# Altium project HYLO Module Rev 1.PrjPcb (part 1 of 2)
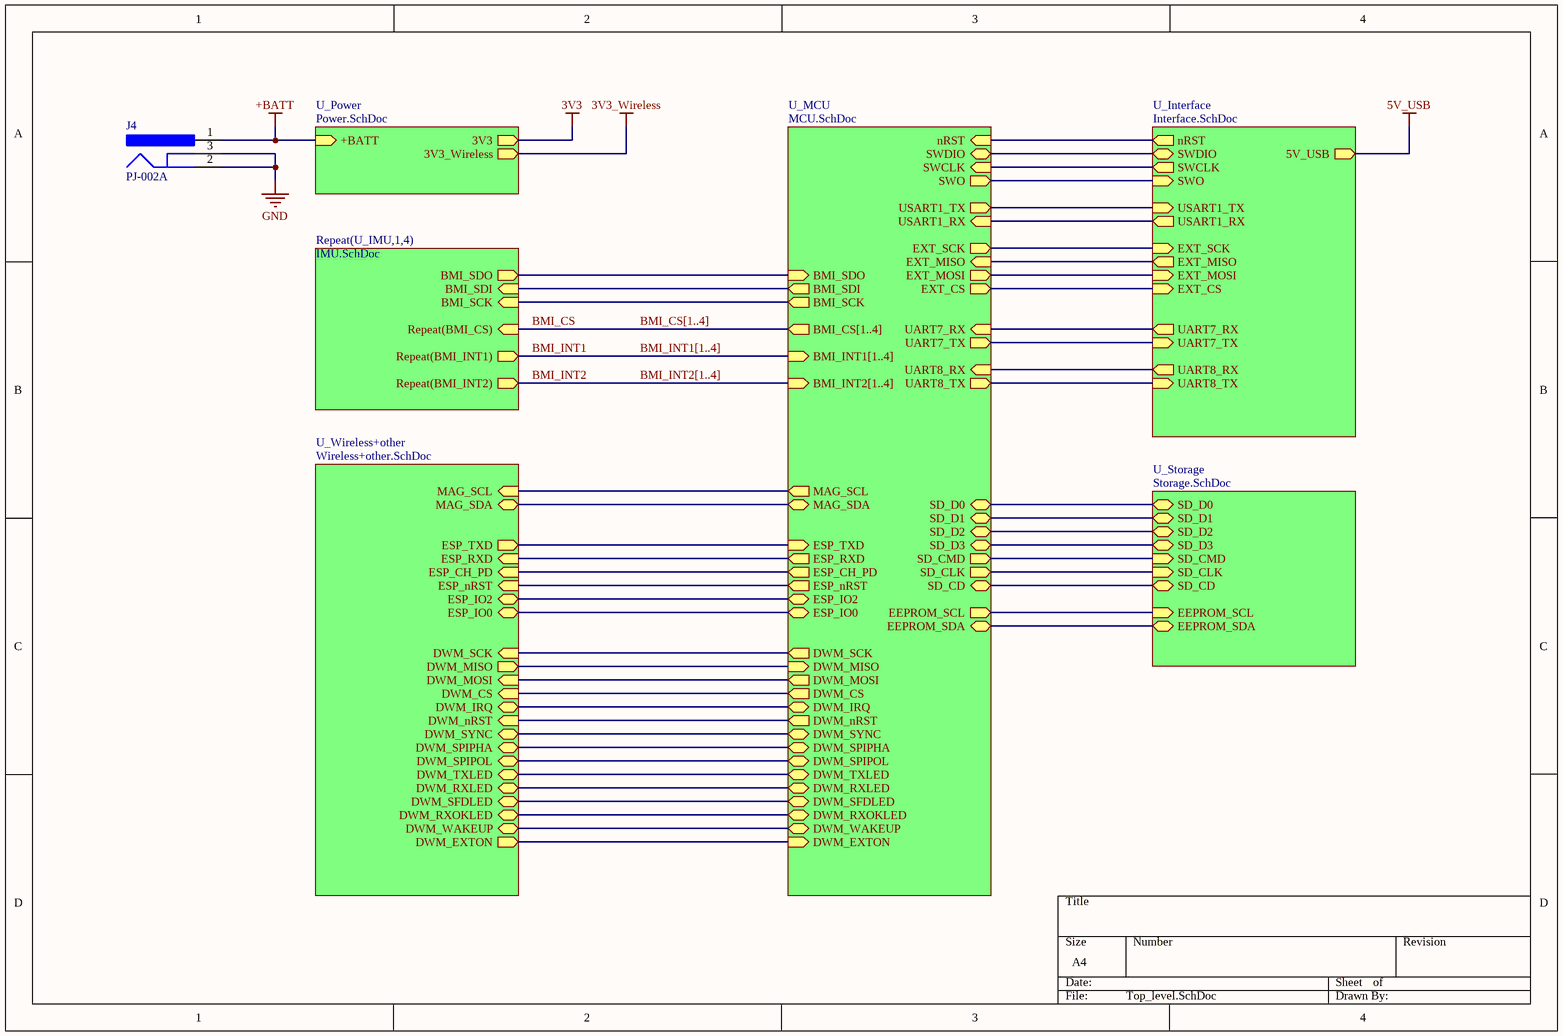
[diagram p0: Top_level.SchDoc]
7 sheets, 122 parts. Net scope: hierarchical (ports join the sheet entries above them; power ports are global).
Board file: PCB1.PcbDoc
Sheets:
  Top_level.SchDoc
    U_MCU = MCU.SchDoc
    U_IMU1 = IMU.SchDoc
    U_IMU2 = IMU.SchDoc
    U_IMU3 = IMU.SchDoc
    U_IMU4 = IMU.SchDoc
    U_Wireless+other = Wireless+other.SchDoc
    U_Interface = Interface.SchDoc
    U_Storage = Storage.SchDoc
    U_Power = Power.SchDoc

## Sheet Top_level.SchDoc
size A4

### Parts
J4  PJ-002A  [CUI-PJ-002A_V]

### Sub-sheets
Repeat(U_IMU,1,4) = IMU.SchDoc: BMI_SDO (out), BMI_SDI (in), BMI_SCK (in), Repeat(BMI_CS) (in), Repeat(BMI_INT1) (out), Repeat(BMI_INT2) (out)
U_Interface = Interface.SchDoc: 5V_USB (out), EXT_SCK (in), EXT_MISO (out), EXT_MOSI (in), EXT_CS (in), SWO (in), nRST (out), UART8_RX (out), UART8_TX (in), SWDIO (bidir), SWCLK (out), UART7_RX (out), UART7_TX (in), USART1_TX (in), USART1_RX (out)
U_MCU = MCU.SchDoc: SWDIO (bidir), SD_D0 (bidir), SD_D1 (bidir), SD_D2 (bidir), SD_D3 (bidir), SD_CD (bidir), SD_CLK (out), SD_CMD (out), EEPROM_SCL (out), EEPROM_SDA (bidir), BMI_CS[1..4] (out), BMI_SDO (in), BMI_SDI (out), BMI_SCK (out), MAG_SCL (out), MAG_SDA (bidir), ESP_RXD (out), ESP_TXD (in), ESP_nRST (out), ESP_CH_PD (out), ESP_IO2 (bidir), ESP_IO0 (bidir), DWM_SCK (out), DWM_MISO (in), DWM_MOSI (out), DWM_CS (out), DWM_nRST (out), DWM_IRQ (bidir), DWM_SYNC (bidir), DWM_SPIPHA (bidir), DWM_SPIPOL (bidir), DWM_TXLED (bidir), DWM_RXLED (bidir), DWM_SFDLED (bidir), DWM_RXOKLED (bidir), DWM_WAKEUP (bidir), DWM_EXTON (in), BMI_INT1[1..4] (in), BMI_INT2[1..4] (in), EXT_SCK (out), EXT_MISO (in), EXT_MOSI (out), EXT_CS (out), SWCLK (in), SWO (out), nRST (in), UART8_TX (out), UART8_RX (in), UART7_RX (in), UART7_TX (out), USART1_TX (out), USART1_RX (in)
U_Power = Power.SchDoc: +BATT (in), 3V3 (out), 3V3_Wireless (out)
U_Storage = Storage.SchDoc: SD_D2 (bidir), SD_D3 (bidir), SD_D1 (bidir), SD_D0 (bidir), SD_CMD (in), SD_CLK (in), SD_CD (bidir), EEPROM_SCL (in), EEPROM_SDA (bidir)
U_Wireless+other = Wireless+other.SchDoc: MAG_SCL (in), MAG_SDA (bidir), ESP_TXD (out), ESP_nRST (in), ESP_CH_PD (in), ESP_IO2 (bidir), ESP_IO0 (bidir), ESP_RXD (in), DWM_SCK (in), DWM_MOSI (in), DWM_MISO (out), DWM_CS (in), DWM_nRST (in), DWM_IRQ (bidir), DWM_EXTON (out), DWM_WAKEUP (bidir), DWM_SYNC (bidir), DWM_SPIPHA (bidir), DWM_SPIPOL (bidir), DWM_TXLED (bidir), DWM_RXLED (bidir), DWM_SFDLED (bidir), DWM_RXOKLED (bidir)

### Nets
+BATT: J4.1 ; sheet U_Power/+BATT
GND: J4.2 J4.3
BMI_CS: sheet Repeat(U_IMU,1,4)/Repeat(BMI_CS)
BMI_INT1: sheet Repeat(U_IMU,1,4)/Repeat(BMI_INT1)
BMI_INT2: sheet Repeat(U_IMU,1,4)/Repeat(BMI_INT2)
BMI_MISO: sheet U_MCU/BMI_SDO, sheet Repeat(U_IMU,1,4)/BMI_SDO
BMI_MOSI: sheet U_MCU/BMI_SDI, sheet Repeat(U_IMU,1,4)/BMI_SDI
BMI_SCK: sheet U_MCU/BMI_SCK, sheet Repeat(U_IMU,1,4)/BMI_SCK
DWM_CS: sheet U_MCU/DWM_CS, sheet U_Wireless+other/DWM_CS
DWM_EXTON: sheet U_MCU/DWM_EXTON, sheet U_Wireless+other/DWM_EXTON
DWM_IRQ: sheet U_MCU/DWM_IRQ, sheet U_Wireless+other/DWM_IRQ
DWM_MISO: sheet U_MCU/DWM_MISO, sheet U_Wireless+other/DWM_MISO
DWM_MOSI: sheet U_MCU/DWM_MOSI, sheet U_Wireless+other/DWM_MOSI
DWM_nRST: sheet U_MCU/DWM_nRST, sheet U_Wireless+other/DWM_nRST
DWM_RXLED: sheet U_MCU/DWM_RXLED, sheet U_Wireless+other/DWM_RXLED
DWM_RXOKLED: sheet U_MCU/DWM_RXOKLED, sheet U_Wireless+other/DWM_RXOKLED
DWM_SCK: sheet U_MCU/DWM_SCK, sheet U_Wireless+other/DWM_SCK
DWM_SFDLED: sheet U_MCU/DWM_SFDLED, sheet U_Wireless+other/DWM_SFDLED
DWM_SPIPHA: sheet U_MCU/DWM_SPIPHA, sheet U_Wireless+other/DWM_SPIPHA
DWM_SPIPOL: sheet U_MCU/DWM_SPIPOL, sheet U_Wireless+other/DWM_SPIPOL
DWM_SYNC: sheet U_MCU/DWM_SYNC, sheet U_Wireless+other/DWM_SYNC
DWM_TXLED: sheet U_MCU/DWM_TXLED, sheet U_Wireless+other/DWM_TXLED
DWM_WAKEUP: sheet U_MCU/DWM_WAKEUP, sheet U_Wireless+other/DWM_WAKEUP
EEPROM_SCL: sheet U_MCU/EEPROM_SCL, sheet U_MCU/MAG_SCL, sheet U_Wireless+other/MAG_SCL, sheet U_Storage/EEPROM_SCL
EEPROM_SDA: sheet U_MCU/EEPROM_SDA, sheet U_MCU/MAG_SDA, sheet U_Wireless+other/MAG_SDA, sheet U_Storage/EEPROM_SDA
ESP_CH_PD: sheet U_MCU/ESP_CH_PD, sheet U_Wireless+other/ESP_CH_PD
ESP_IO0: sheet U_MCU/ESP_IO0, sheet U_Wireless+other/ESP_IO0
ESP_IO2: sheet U_MCU/ESP_IO2, sheet U_Wireless+other/ESP_IO2
ESP_nRST: sheet U_MCU/ESP_nRST, sheet U_Wireless+other/ESP_nRST
ESP_RXD: sheet U_MCU/ESP_RXD, sheet U_Wireless+other/ESP_RXD
ESP_TXD: sheet U_MCU/ESP_TXD, sheet U_Wireless+other/ESP_TXD
EXT_CS: sheet U_MCU/EXT_CS, sheet U_Interface/EXT_CS
EXT_MISO: sheet U_MCU/EXT_MISO, sheet U_Interface/EXT_MISO
EXT_MOSI: sheet U_MCU/EXT_MOSI, sheet U_Interface/EXT_MOSI
EXT_RX: sheet U_MCU/UART7_TX, sheet U_Interface/UART7_TX
EXT_SCK: sheet U_MCU/EXT_SCK, sheet U_Interface/EXT_SCK
EXT_TX: sheet U_MCU/UART7_RX, sheet U_Interface/UART7_RX
nRST: sheet U_MCU/nRST, sheet U_Interface/nRST
SD_CD: sheet U_MCU/SD_CD, sheet U_Storage/SD_CD
SD_CLK: sheet U_MCU/SD_CLK, sheet U_Storage/SD_CLK
SD_CMD: sheet U_MCU/SD_CMD, sheet U_Storage/SD_CMD
SD_D0: sheet U_MCU/SD_D0, sheet U_Storage/SD_D0
SD_D1: sheet U_MCU/SD_D1, sheet U_Storage/SD_D1
SD_D2: sheet U_MCU/SD_D2, sheet U_Storage/SD_D2
SD_D3: sheet U_MCU/SD_D3, sheet U_Storage/SD_D3
SWCLK: sheet U_MCU/SWCLK, sheet U_Interface/SWCLK
SWDIO: sheet U_MCU/SWDIO, sheet U_Interface/SWDIO
SWO: sheet U_MCU/SWO, sheet U_Interface/SWO
T_VCP_RX: sheet U_MCU/UART8_RX, sheet U_Interface/UART8_RX
T_VCP_TX: sheet U_MCU/UART8_TX, sheet U_Interface/UART8_TX
USART1_RX: sheet U_MCU/USART1_RX, sheet U_Interface/USART1_RX
USART1_TX: sheet U_MCU/USART1_TX, sheet U_Interface/USART1_TX

### Buses and harness runs
bus BMI_CS[1..4] = sheet U_MCU/BMI_CS[1..4]
bus BMI_INT1[1..4] = sheet U_MCU/BMI_INT1[1..4]
bus BMI_INT2[1..4] = sheet U_MCU/BMI_INT2[1..4]

### Library data of the parts
J4 = CMP-2000-06895-2: Through Hole Right Angle DC Power Jack, 2.5 A, 2 mm Center Pin, 3 Position, -25 to 85 degC, RoHS, Bulk; Manufacturer: CUIInc.; Brand: CUI; Inside Contact Diameter: 2mm; Voltage Rating: 24V; Outside Contact Diameter: 6.5mm; Current Rating: 2.5A; Insulation Resistance: 50MOhms; Contact Gender: Male; Connector Type: DCPowerJack; Datasheet Version: Rev. 1.03, 04/2016; Housing Material: PolybutyleneTerephthalate(PBT); Operating Temperature Range: -25Cto+85C; Termination Style: ThroughHole; Product Category: DCPowerConnectors; Mounting Technology: ThroughHole; Mounting Style: ThroughHole; Factory Pack Quantity: 500; Contact Plating: Nickel; Package Reference: PJ-002A; Mounting Angle: Right; Package Description: 3-Pin Through Hole Device, Body 14.4 x 9 mm, Height 11 mm; Flammability Rating: UL94V-0; Manufacturer URL: http://www.cui.com/; Product: Jacks; Contact Material: Copper; Datasheet URL: http://www.cui.com/product/resource/pj-002a.pdf; RoHS: True

## Sheet MCU.SchDoc
size A3
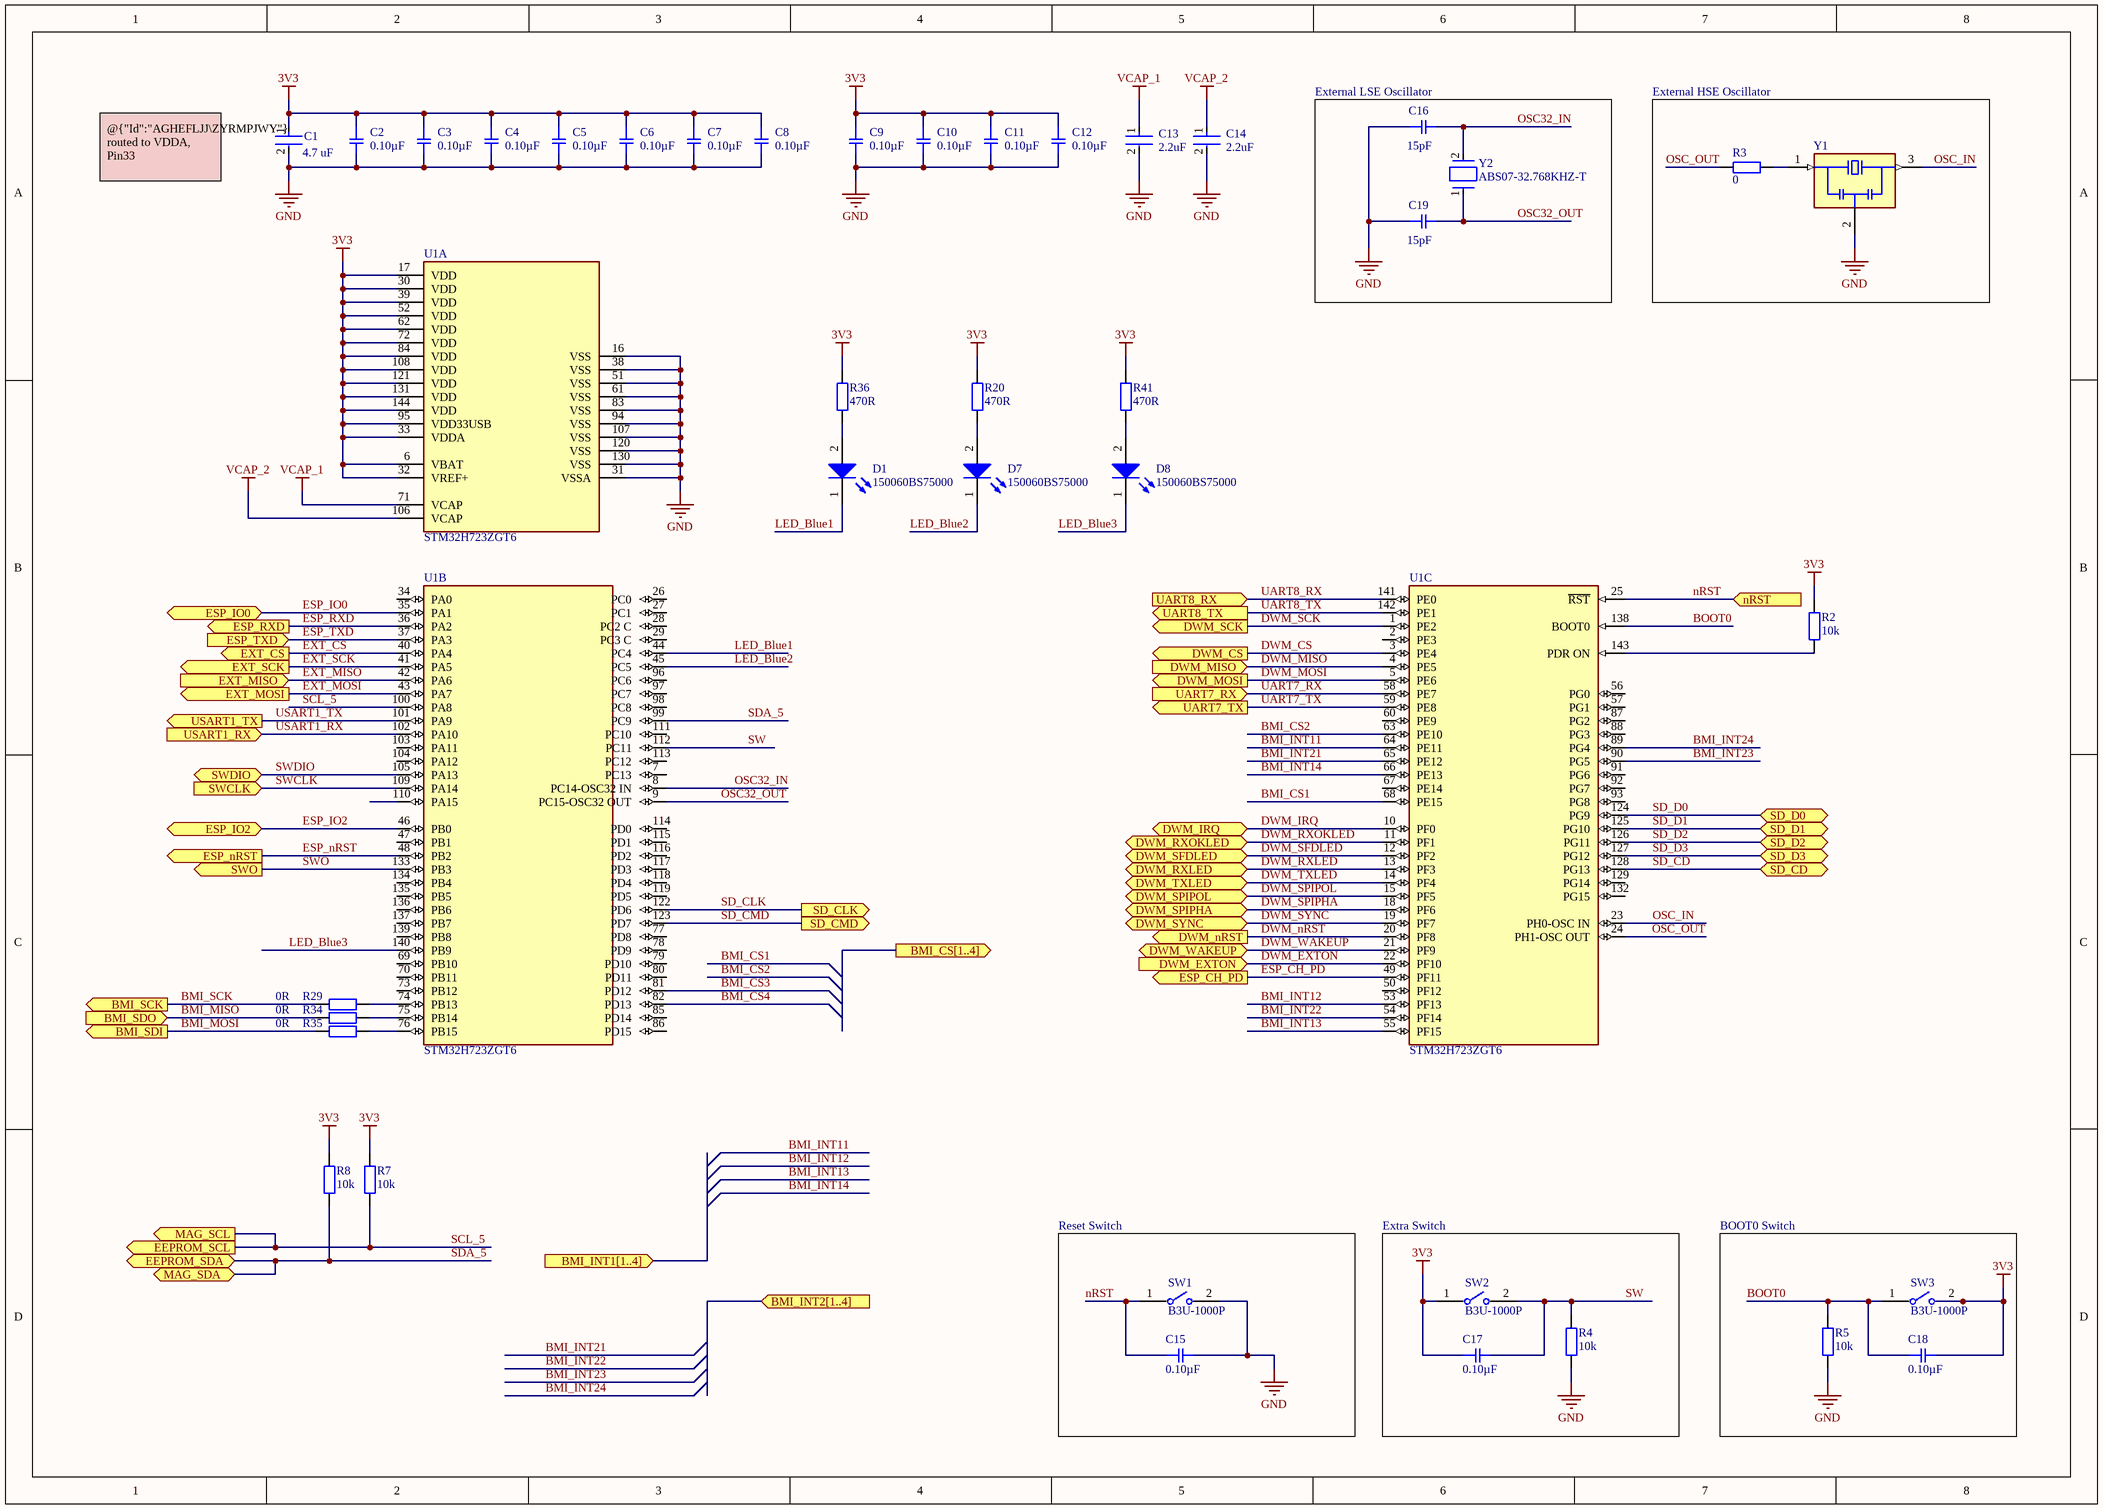
[diagram p1: MCU.SchDoc]

### Parts
C1  value 4.7 uF  [FP-CC0805-0_85-MFG]  (hidden comment: CC0805KKX7R8BB475)
C2  value 0.10µF  [SMD-0402C]  (hidden comment: GRM155R61A104KA01J)
C3  value 0.10µF  [SMD-0402C]  (hidden comment: GRM155R61A104KA01J)
C4  value 0.10µF  [SMD-0402C]  (hidden comment: GRM155R61A104KA01J)
C5  value 0.10µF  [SMD-0402C]  (hidden comment: GRM155R61A104KA01J)
C6  value 0.10µF  [SMD-0402C]  (hidden comment: GRM155R61A104KA01J)
C7  value 0.10µF  [SMD-0402C]  (hidden comment: GRM155R61A104KA01J)
C8  value 0.10µF  [SMD-0402C]  (hidden comment: GRM155R61A104KA01J)
C9  value 0.10µF  [SMD-0402C]  (hidden comment: GRM155R61A104KA01J)
C10  value 0.10µF  [SMD-0402C]  (hidden comment: GRM155R61A104KA01J)
C11  value 0.10µF  [SMD-0402C]  (hidden comment: GRM155R61A104KA01J)
C12  value 0.10µF  [SMD-0402C]  (hidden comment: GRM155R61A104KA01J)
C13  Capacitance: 2.2uF  [FP-GRM21B-0_15-IPC_A]  (hidden comment: GRM21BR71E225KE11L)
C14  Capacitance: 2.2uF  [FP-GRM21B-0_15-IPC_A]  (hidden comment: GRM21BR71E225KE11L)
C15  value 0.10µF  [SMD-0402C]  (hidden comment: GRM155R61A104KA01J)
C16  value 15pF  [SMD-0402C]  (hidden comment: GRM1555C1H150FA01D)
C17  value 0.10µF  [SMD-0402C]  (hidden comment: GRM155R61A104KA01J)
C18  value 0.10µF  [SMD-0402C]  (hidden comment: GRM155R61A104KA01J)
C19  value 15pF  [SMD-0402C]  (hidden comment: GRM1555C1H150FA01D)
D1  150060BS75000  [WL-SMCW_0603_150060xx75000]
D7  150060BS75000  [WL-SMCW_0603_150060xx75000]
D8  150060BS75000  [WL-SMCW_0603_150060xx75000]
R2  10k  [IPC C R0402 NO SILK]
R3  value 0  [IPC C R0402 NO SILK]  (hidden comment: 0R)
R4  10k  [IPC C R0402 NO SILK]
R5  10k  [IPC C R0402 NO SILK]
R7  10k  [IPC C R0402 NO SILK]
R8  10k  [IPC C R0402 NO SILK]
R20  470R  [IPC C R0402 NO SILK]
R29  0R  [IPC C R0402 NO SILK]
R34  0R  [IPC C R0402 NO SILK]
R35  0R  [IPC C R0402 NO SILK]
R36  470R  [IPC C R0402 NO SILK]
R41  470R  [IPC C R0402 NO SILK]
SW1  B3U-1000P  [FP-B3U-1000P-MFG]
SW2  B3U-1000P  [FP-B3U-1000P-MFG]
SW3  B3U-1000P  [FP-B3U-1000P-MFG]
U1  STM32H723ZGT6  [FP-LQFP144-1A-IPC_A]  (parts A,B,C of 3)
Y1  CSTNE8M00G550000R0  [OSC_CSTNE8M00G550000R0]  (value not drawn)
Y2  ABS07-32.768KHZ-T  [FP-ABS07-MFG]

### Blocks framed on the sheet
External LSE Oscillator: C16 C19 Y2
External HSE Oscillator: R3 Y1
Reset Switch: C15 SW1
Extra Switch: C17 R4 SW2
BOOT0 Switch: C18 R5 SW3

### Ports
BMI_CS[1..4] (out), BMI_INT1[1..4] (in), BMI_INT2[1..4] (in), BMI_SCK (out), BMI_SDI (out), BMI_SDO (in), DWM_CS (out), DWM_EXTON (in), DWM_IRQ (bidir), DWM_MISO (in), DWM_MOSI (out), DWM_nRST (out), DWM_RXLED (bidir), DWM_RXOKLED (bidir), DWM_SCK (out), DWM_SFDLED (bidir), DWM_SPIPHA (bidir), DWM_SPIPOL (bidir), DWM_SYNC (bidir), DWM_TXLED (bidir), DWM_WAKEUP (bidir), EEPROM_SCL (out), EEPROM_SDA (bidir), ESP_CH_PD (out), ESP_IO0 (bidir), ESP_IO2 (bidir), ESP_nRST (out), ESP_RXD (out), ESP_TXD (in), EXT_CS (out), EXT_MISO (in), EXT_MOSI (out), EXT_SCK (out), MAG_SCL (out), MAG_SDA (bidir), nRST (in), SD_CD (bidir), SD_CLK (out), SD_CMD (out), SD_D0 (bidir), SD_D1 (bidir), SD_D2 (bidir), SD_D3 (bidir), SWCLK (in), SWDIO (bidir), SWO (out), UART7_RX (in), UART7_TX (out), UART8_RX (in), UART8_TX (out), USART1_RX (in), USART1_TX (out)

### Nets
3V3: C1.1 C2.1 C3.1 C4.1 C5.1 C6.1 C7.1 C8.1 C9.1 C10.1 C11.1 C12.1 C17.1 C18.2 R2.1 R7.1 R8.1 R20.2 R36.2 R41.2 SW2.1 SW3.2 U1.6(VBAT) U1.17(VDD) U1.30(VDD) U1.32(VREF+) U1.33(VDDA) U1.39(VDD) U1.52(VDD) U1.62(VDD) U1.72(VDD) U1.84(VDD) U1.95(VDD33USB) U1.108(VDD) U1.121(VDD) U1.131(VDD) U1.144(VDD)
GND: C1.2 C2.2 C3.2 C4.2 C5.2 C6.2 C7.2 C8.2 C9.2 C10.2 C11.2 C12.2 C13.2 C14.2 C15.2 C16.1 C19.1 R4.1 R5.1 SW1.2 U1.16(VSS) U1.31(VSSA) U1.38(VSS) U1.51(VSS) U1.61(VSS) U1.83(VSS) U1.94(VSS) U1.107(VSS) U1.120(VSS) U1.130(VSS) Y1.2(GND)
VCAP_1: C13.1 U1.71(VCAP)
VCAP_2: C14.1 U1.106(VCAP)
BMI_CS1: U1.68(PE15)
BMI_CS2: U1.63(PE10)
BMI_CS3: U1.81(PD12)
BMI_CS4: U1.82(PD13)
BMI_INT11: U1.64(PE11)
BMI_INT12: U1.53(PF13)
BMI_INT13: U1.55(PF15)
BMI_INT14: U1.66(PE13)
BMI_INT21: U1.65(PE12)
BMI_INT22: U1.54(PF14)
BMI_INT23: U1.90(PG5)
BMI_INT24: U1.89(PG4)
BMI_MISO: R34.1 ; port BMI_SDO
BMI_MOSI: R35.1 ; port BMI_SDI
BMI_SCK: R29.1 ; port BMI_SCK
BOOT0: C18.1 R5.2 SW3.1 U1.138(BOOT0)
DWM_CS: U1.3(PE4) ; port DWM_CS
DWM_EXTON: U1.22(PF10) ; port DWM_EXTON
DWM_IRQ: U1.10(PF0) ; port DWM_IRQ
DWM_MISO: U1.4(PE5) ; port DWM_MISO
DWM_MOSI: U1.5(PE6) ; port DWM_MOSI
DWM_nRST: U1.20(PF8) ; port DWM_nRST
DWM_RXLED: U1.13(PF3) ; port DWM_RXLED
DWM_RXOKLED: U1.11(PF1) ; port DWM_RXOKLED
DWM_SCK: U1.1(PE2) ; port DWM_SCK
DWM_SFDLED: U1.12(PF2) ; port DWM_SFDLED
DWM_SPIPHA: U1.18(PF6) ; port DWM_SPIPHA
DWM_SPIPOL: U1.15(PF5) ; port DWM_SPIPOL
DWM_SYNC: U1.19(PF7) ; port DWM_SYNC
DWM_TXLED: U1.14(PF4) ; port DWM_TXLED
DWM_WAKEUP: U1.21(PF9) ; port DWM_WAKEUP
ESP_CH_PD: U1.49(PF11) ; port ESP_CH_PD
ESP_IO0: U1.35(PA1) ; port ESP_IO0
ESP_IO2: U1.46(PB0) ; port ESP_IO2
ESP_nRST: U1.48(PB2) ; port ESP_nRST
ESP_RXD: U1.36(PA2) ; port ESP_RXD
ESP_TXD: U1.37(PA3) ; port ESP_TXD
EXT_CS: U1.40(PA4) ; port EXT_CS
EXT_MISO: U1.42(PA6) ; port EXT_MISO
EXT_MOSI: U1.43(PA7) ; port EXT_MOSI
EXT_SCK: U1.41(PA5) ; port EXT_SCK
LED_Blue1: D1.1(K) U1.44(PC4)
LED_Blue2: D7.1(K) U1.45(PC5)
LED_Blue3: D8.1(K) U1.140(PB9)
nRST: C15.1 SW1.1 U1.25(~{RST}) ; port nRST
OSC32_IN: C16.2 U1.8(PC14-OSC32_IN) Y2.2
OSC32_OUT: C19.2 U1.9(PC15-OSC32_OUT) Y2.1
OSC_IN: U1.23(PH0-OSC_IN) Y1.3(OUT)
OSC_OUT: R3.2 U1.24(PH1-OSC_OUT)
SCL_5: R7.2 U1.100(PA8) ; port EEPROM_SCL, port MAG_SCL  [project net EEPROM_SCL]
SD_CD: U1.128(PG13) ; port SD_CD
SD_CLK: U1.122(PD6) ; port SD_CLK
SD_CMD: U1.123(PD7) ; port SD_CMD
SD_D0: U1.124(PG9) ; port SD_D0
SD_D1: U1.125(PG10) ; port SD_D1
SD_D2: U1.126(PG11) ; port SD_D2
SD_D3: U1.127(PG12) ; port SD_D3
SDA_5: R8.2 U1.99(PC9) ; port EEPROM_SDA, port MAG_SDA  [project net EEPROM_SDA]
SW: C17.2 R4.2 SW2.2 U1.112(PC11)
SWCLK: U1.109(PA14) ; port SWCLK
SWDIO: U1.105(PA13) ; port SWDIO
SWO: U1.133(PB3) ; port SWO
UART7_RX: U1.58(PE7) ; port UART7_RX  [project net EXT_TX]
UART7_TX: U1.59(PE8) ; port UART7_TX  [project net EXT_RX]
UART8_RX: U1.141(PE0) ; port UART8_RX  [project net T_VCP_RX]
UART8_TX: U1.142(PE1) ; port UART8_TX  [project net T_VCP_TX]
USART1_RX: U1.102(PA10) ; port USART1_RX
USART1_TX: U1.101(PA9) ; port USART1_TX
NetD1_2: D1.2(A) R36.1
NetD7_2: D7.2(A) R20.1
NetD8_2: D8.2(A) R41.1
NetR2_2: R2.2 U1.143(PDR_ON)
NetR3_1: R3.1 Y1.1(IN)
NetR29_2: R29.2 U1.74(PB13)
NetR34_2: R34.2 U1.75(PB14)
NetR35_2: R35.2 U1.76(PB15)

Not connected (* = marked no-connect by the designer): U1 2(PE3) 7(PC13) 26(PC0) 27(PC1) 28(PC2_C) 29(PC3_C) 34(PA0) 47(PB1) 50(PF12) 56(PG0) 57(PG1) 60(PE9) 67(PE14) 69(PB10) 70(PB11) 73(PB12) 77(PD8) 78(PD9) 79(PD10) 80(PD11) 85(PD14) 86(PD15) 87(PG2) 88(PG3) 91(PG6) 92(PG7) 93(PG8) 96(PC6) 97(PC7) 98(PC8) 103(PA11) 104(PA12) 110(PA15) 111(PC10) 113(PC12) 114(PD0) 115(PD1) 116(PD2) 117(PD3) 118(PD4) 119(PD5) 129(PG14) 132(PG15) 134(PB4) 135(PB5) 136(PB6) 137(PB7) 139(PB8)

### Notes on the sheet
- @{"Id":"AGHEFLJJ\ZYRMPJWY"} routed to VDDA, Pin33

### Library data of the parts
C1 = CMP-03422-000306-1: CAP CER 4.7UF 25V X7R 0805; Manufacturer: Yageo; Material: Ceramic; Tolerance: 0.1; ComponentLink2Description: Datasheet; Footprint Url: http://www.yageo.com/exep/pages/download/literatures/UPY-C_GEN_24.pdf; Temperature Range High: +85°C; Package: CC0805-0.85; Octopart: https://octopart.com/cc0805kkx7r8bb475-yageo-51849247; Mouser Description: Multilayer Ceramic Capacitors MLCC - SMD/SMT 4.7M pF 10% 25 Volts; Capacitance: 4.7 uF; Ipc Land Pattern Name: CAPC200125X85; Temperature: -30°C to +85°C; Digikey Description: CAP CER 4.7UF 25V X7R 0805; Temperature Characteristic: X7R; Temperature Range Low: -30°C; Lead Free: Yes; RoHS: TRUE; Device Class L3: Ceramic Capacitors; ComponentLink2URL: http://www.yageo.com/documents/recent/UPY-GPHC_Y5V_6.3V-to-50V_8.pdf; Category: Cap; Device Class L2: Capacitors; Manufacturer Part Number: CC0805KKX7R8BB475; Device Class L1: Passive Components; Height: 0.95mm; Automotive: No; Voltage Rating: 25 V
C2-C12 C15 C17 C18 = CMP-140-000687-1: CAP CER 0.1UF 10V X5R 0402; Manufacturer: Murata Electronics North America; Factory Stock: 0; Unit Price (USD): 0.1; Minimum Quantity: 1; Tolerance: ±10%; Ratings: -; Lead Spacing: -; Source: capacitor_murata_0402$.SchLib; Part Status: Active; Pin Count: 2; Digi-Key Part Number: 490-6297-1-ND; Operating Temperature: -55°C ~ 85°C; Height - Seated (Max): -; Voltage: 10V; @ qty: 0; Temperature Coefficient: X5R; Package / Case: 0402 (1005 Metric); Size / Dimension: 0.039" L x 0.020" W (1.00mm x 0.50mm); Quantity Available: 24406; Datasheets: http://www.murata.com/~/media/webrenewal/support/library/catalog/products/capacitor/mlcc/c02e.pdf; Series: GRM; Applications: General Purpose; Thickness (Max): 0.022" (0.55mm); Image: //media.digikey.com/Renders/Murata%20Renders/ZRB-SERIES-0402.jpg; Packaging: Cut Tape (CT); Part Number: GRM155R61A104KA01J; Features: -; Component Type: Standard; Mounting Type: Surface Mount, MLCC; Design Item ID: GRM155R61A104KA01J
C13 C14 = CMP-06035-028354-1: Chip Multilayer Ceramic Capacitors for General Purpose, 0805, 2.2uF, X7R, 15%, 10%, 25V; Voltage Rating (DC): 25V; Thickness: 1.25mm; Dielectric: X7R; Tolerance: 10%; Length: 2mm; Width: 1.25mm
C16 C19 = CMP-140-000297-1: CAP CER 15PF 50V NP0 0402; Manufacturer: Murata Electronics North America; Minimum Quantity: 1; Factory Stock: 0; Tolerance: ±1%; Unit Price (USD): 0.1; Temperature Coefficient: C0G, NP0; Component Type: Standard; Features: -; Part Status: Active; Thickness (Max): 0.022" (0.55mm); Quantity Available: 187310; Design Item ID: GRM1555C1H150FA01D; Datasheets: http://www.murata.com/~/media/webrenewal/support/library/catalog/products/capacitor/mlcc/c02e.pdf; Image: //media.digikey.com/Renders/Murata%20Renders/ZRB-SERIES-0402.jpg; Applications: General Purpose; Packaging: Cut Tape (CT); Height - Seated (Max): -; Source: capacitor_murata_0402$.SchLib; Ratings: -; Lead Style: -; Voltage: 50V; Lead Spacing: -; Pin Count: 2; Mounting Type: Surface Mount, MLCC; Digi-Key Part Number: 490-6200-1-ND; Size / Dimension: 0.039" L x 0.020" W (1.00mm x 0.50mm); Package / Case: 0402 (1005 Metric); Operating Temperature: -55°C ~ 125°C; Series: GRM; Part Number: GRM1555C1H150FA01D; @ qty: 0
D1 D7 D8 = CMP-1426-00003-4: Led, Blue, 470 Nm, 3.2 V, 30 Ma, 145 Mcd Rohs Compliant: Yes; Peak Wavelength: 465nm; Dominant Wavelength: 470nm; Power Dissipation: 105mW; Viewing Angle: 140°; Test Current: 20mA; Max Junction Temperature (Tj): 95°C; Forward Current: 100mA; Reverse Voltage: 5V; Luminous Intensity: 145mcd; Lens Style: Clear, Rectangular; Forward Voltage: 3.2V; RoHS: Compliant; Min Operating Temperature: -40°C; REACH SVHC: Unknown; Max Operating Temperature: 85°C; Width: 800µm; Case Code (Imperial): 0603; Case Code (Metric): 1608; Max Reverse Voltage (DC): 5V; Height: 700µm; Case/Package: 0603; Mount: Surface Mount; Packaging: Tape and Reel; Color: Blue; Wavelength: 470nm; Length: 1.6mm
R2-R5 R7 R8 R20 R29 R34-R36 R41 = CMP-009-00183-1: Design Item ID: Generic RES 0402; Source: Schlib1.SchLib
  R2 R4 R5 R7 R8: Value: 10k
  R20 R36 R41: Value: 470R
  R29 R34 R35: Value: 0R
SW1-SW3 = CMP-2100-03586-2: SWITCH TACTILE SPST-NO 0.05A 12V; Contact Resistance: 100mR; Operating Force: 1.5N; Max Current Rating: 50mA; Switch Travel: 0.15mm; Actuator Type: Standard; Mechanical Life: 200000Cycles; Ratings: Dust Proof; Illumination Type: Non-Illuminated; Throw Configuration: SPST; Actuator Length: 0.4mm; Switch Function: Off-Mom; Height: 1.2mm; Width: 3mm; Weight: 0.000776oz; Contact Material: Silver; Max Voltage Rating (DC): 12V; Insulation Resistance: 100MR; Lead Free: Lead Free; Current Rating: 50mA; Termination: SMD/SMT; Length: 4mm; Voltage Rating (DC): 12V; Contact Current Rating: 50mA; Orientation: Straight; Depth: 2.5mm; Max Operating Temperature: 70°C; Packaging: Tape and Reel; Min Operating Temperature: -25°C; Package Quantity: 1; Mount: Surface Mount; Electrical Life: 200000Cycles
U1 = CMP-12105-000148-1: IC MCU 32BIT 1MB FLASH 144LQFP
Y1 = CMP-001-00084-2: 8 MHz Ceramic Resonator Built in Capacitor 33 pF Â±0.2% 40 Ohms -40Â°C ~ 85Â°C Surface Mount; MF: Murata Electronics; Check_prices: https://www.snapeda.com/parts/CSTNE8M00G550000R0/Murata+Electronics+North+America/view-part/?ref=eda; Case/Package: SMD-3 Murata; Source: CSTNE8M00G550000R0.SchLib; SnapEDA_Link: https://www.snapeda.com/parts/CSTNE8M00G550000R0/Murata+Electronics+North+America/view-part/?ref=snap; MP: CSTNE8M00G550000R0; Design Item ID: CSTNE8M00G550000R0; Component Type: Standard; Pins: 3
Y2 = CMP-0447-00001-4: Crystal 32.768kHz ±20ppm (Tol) 12.5pF FUND 70kΩ 2-Pin CSMD T/R; ESR (Equivalent Series Resistance): 70kR; Radiation Hardening: No; Frequency: 32.768kHz; Length: 3.2mm; Max Operating Temperature: 85°C; Number of Pins: 2; Series: ABS07; Min Operating Temperature: -40°C; Frequency Tolerance: 20ppm; Packaging: Tape and Reel; Height: 0.9mm; Width: 1.5mm; Depth: 1.5mm; Load Capacitance: 12.5pF; RoHS Compliant: Yes; Tolerance: 20ppm; Termination: SMD/SMT; Lead Free: Lead Free; Series Resistance: 70kR; REACH SVHC: No SVHC; Case/Package: CSMD; Operating Frequency: 32.768 kHz; Package Quantity: 3000

## Sheet IMU.SchDoc
size A4
Used 4 times, as channels U_IMU1, U_IMU2, U_IMU3, U_IMU4. Parts and nets are listed once, with the designators drawn on the sheet.
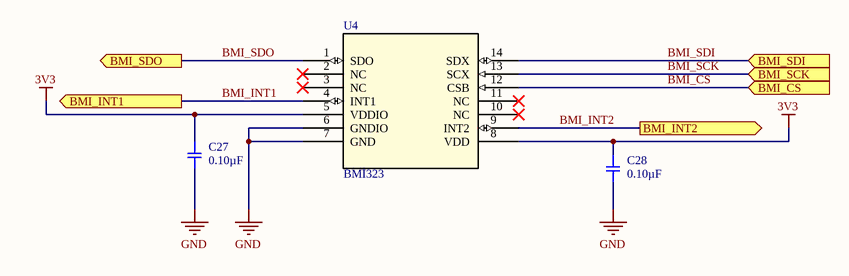
[diagram p2: IMU.SchDoc]

### Parts
C27  value 0.10µF  [SMD-0402C]  (hidden comment: GRM155R61A104KA01J)
C28  value 0.10µF  [SMD-0402C]  (hidden comment: GRM155R61A104KA01J)
U4  BMI323  [BMI323_BOS]

### Ports
BMI_CS (in), BMI_INT1 (out), BMI_INT2 (out), BMI_SCK (in), BMI_SDI (in), BMI_SDO (out)

### Nets
3V3: C27.1 C28.1 U4.5(VDDIO) U4.8(VDD)
GND: C27.2 C28.2 U4.6(GNDIO) U4.7(GND)
BMI_CS: U4.12(CSB) ; port BMI_CS
BMI_INT1: U4.4(INT1) ; port BMI_INT1
BMI_INT2: U4.9(INT2) ; port BMI_INT2
BMI_SCK: U4.13(SCX) ; port BMI_SCK
BMI_SDI: U4.14(SDX) ; port BMI_SDI
BMI_SDO: U4.1(SDO) ; port BMI_SDO

Not connected (* = marked no-connect by the designer): U4 2(NC)* 3(NC)* 10(NC)* 11(NC)*

### Channels
U_IMU1: designators end in _U_IMU1; ports BMI_CS=BMI_CS_U_IMU1 BMI_INT1=BMI_INT1_U_IMU1 BMI_INT2=BMI_INT2_U_IMU1 BMI_SCK=BMI_SCK BMI_SDI=BMI_MOSI BMI_SDO=BMI_MISO
U_IMU2: designators end in _U_IMU2; ports BMI_CS=BMI_CS_U_IMU2 BMI_INT1=BMI_INT1_U_IMU2 BMI_INT2=BMI_INT2_U_IMU2 BMI_SCK=BMI_SCK BMI_SDI=BMI_MOSI BMI_SDO=BMI_MISO
U_IMU3: designators end in _U_IMU3; ports BMI_CS=BMI_CS_U_IMU3 BMI_INT1=BMI_INT1_U_IMU3 BMI_INT2=BMI_INT2_U_IMU3 BMI_SCK=BMI_SCK BMI_SDI=BMI_MOSI BMI_SDO=BMI_MISO
U_IMU4: designators end in _U_IMU4; ports BMI_CS=BMI_CS_U_IMU4 BMI_INT1=BMI_INT1_U_IMU4 BMI_INT2=BMI_INT2_U_IMU4 BMI_SCK=BMI_SCK BMI_SDI=BMI_MOSI BMI_SDO=BMI_MISO

### Library data of the parts
C27 C28 = CMP-140-000687-1: as C2 on sheet MCU; Ratings: -; Lead Spacing: -; Source: capacitor_murata_0402$.SchLib; Part Status: Active; Pin Count: 2; Digi-Key Part Number: 490-6297-1-ND; Operating Temperature: -55°C ~ 85°C; Height - Seated (Max): -; Voltage: 10V; @ qty: 0; Temperature Coefficient: X5R; Package / Case: 0402 (1005 Metric); Size / Dimension: 0.039" L x 0.020" W (1.00mm x 0.50mm); Quantity Available: 24406; Datasheets: http://www.murata.com/~/media/webrenewal/support/library/catalog/products/capacitor/mlcc/c02e.pdf; Series: GRM; Applications: General Purpose; Thickness (Max): 0.022" (0.55mm); Image: //media.digikey.com/Renders/Murata%20Renders/ZRB-SERIES-0402.jpg; Packaging: Cut Tape (CT); Part Number: GRM155R61A104KA01J; Features: -; Component Type: Standard; Mounting Type: Surface Mount, MLCC; Design Item ID: GRM155R61A104KA01J
U4 = CMP-036-000000-1: Description; Manufacturer_Name: Bosch Sensortec; Design Item ID: BMI323; Pin Count: 14; RefDes: RefDes; Type: Type; Manufacturer_Part_Number: BMI323; Copyright: Copyright (C) 2025 Ultra Librarian. All rights reserved.; Source: BMI323.SchLib; Component Type: Standard

## Sheet Wireless+other.SchDoc
size A4
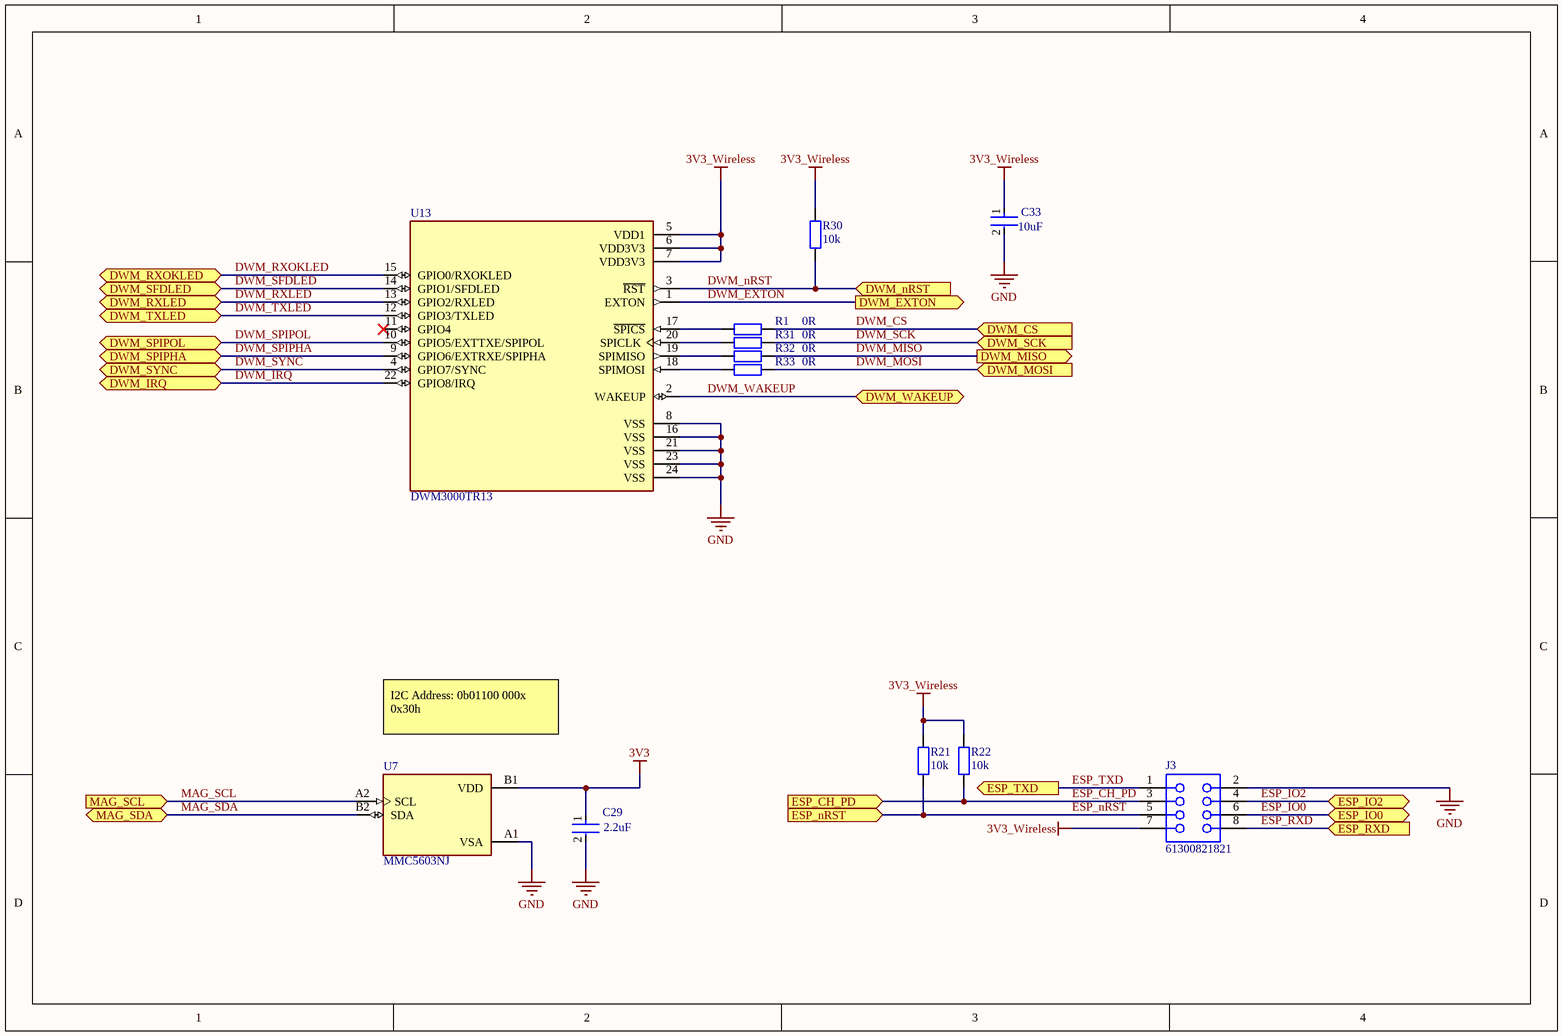
[diagram p3: Wireless+other.SchDoc]

### Parts
C29  Capacitance: 2.2uF  [FP-GRM155-0_05-MFG]  (hidden comment: GRM155R61A225KE95D)
C33  Capacitance: 10uF  [FP-GRM18-0_15-MFG]  (hidden comment: GRM188R61A106KE69D)
J3  61300821821  [61300821821]
R1  0R  [IPC C R0402 NO SILK]
R21  10k  [IPC C R0402 NO SILK]
R22  10k  [IPC C R0402 NO SILK]
R30  10k  [IPC C R0402 NO SILK]
R31  0R  [IPC C R0402 NO SILK]
R32  0R  [IPC C R0402 NO SILK]
R33  0R  [IPC C R0402 NO SILK]
U7  MMC5603NJ  [XDCR_MMC5603NJ]
U13  DWM3000TR13  [XCVR_DWM3000TR13]

### Ports
DWM_CS (in), DWM_EXTON (out), DWM_IRQ (bidir), DWM_MISO (out), DWM_MOSI (in), DWM_nRST (in), DWM_RXLED (bidir), DWM_RXOKLED (bidir), DWM_SCK (in), DWM_SFDLED (bidir), DWM_SPIPHA (bidir), DWM_SPIPOL (bidir), DWM_SYNC (bidir), DWM_TXLED (bidir), DWM_WAKEUP (bidir), ESP_CH_PD (in), ESP_IO0 (bidir), ESP_IO2 (bidir), ESP_nRST (in), ESP_RXD (in), ESP_TXD (out), MAG_SCL (in), MAG_SDA (bidir)

### Nets
3V3: C29.1 U7.B1(VDD)
3V3_Wireless: C33.1 J3.7 R21.1 R22.1 R30.2 U13.5(VDD1) U13.6(VDD3V3) U13.7(VDD3V3)
GND: C29.2 C33.2 J3.2 U7.A1(VSA) U13.8(VSS) U13.16(VSS) U13.21(VSS) U13.23(VSS) U13.24(VSS)
DWM_CS: R1.1 ; port DWM_CS
DWM_EXTON: U13.1(EXTON) ; port DWM_EXTON
DWM_IRQ: U13.22(GPIO8/IRQ) ; port DWM_IRQ
DWM_MISO: R32.1 ; port DWM_MISO
DWM_MOSI: R33.1 ; port DWM_MOSI
DWM_nRST: R30.1 U13.3(~{RST}) ; port DWM_nRST
DWM_RXLED: U13.13(GPIO2/RXLED) ; port DWM_RXLED
DWM_RXOKLED: U13.15(GPIO0/RXOKLED) ; port DWM_RXOKLED
DWM_SCK: R31.1 ; port DWM_SCK
DWM_SFDLED: U13.14(GPIO1/SFDLED) ; port DWM_SFDLED
DWM_SPIPHA: U13.9(GPIO6/EXTRXE/SPIPHA) ; port DWM_SPIPHA
DWM_SPIPOL: U13.10(GPIO5/EXTTXE/SPIPOL) ; port DWM_SPIPOL
DWM_SYNC: U13.4(GPIO7/SYNC) ; port DWM_SYNC
DWM_TXLED: U13.12(GPIO3/TXLED) ; port DWM_TXLED
DWM_WAKEUP: U13.2(WAKEUP) ; port DWM_WAKEUP
ESP_CH_PD: J3.3 R22.2 ; port ESP_CH_PD
ESP_IO0: J3.6 ; port ESP_IO0
ESP_IO2: J3.4 ; port ESP_IO2
ESP_nRST: J3.5 R21.2 ; port ESP_nRST
ESP_RXD: J3.8 ; port ESP_RXD
ESP_TXD: J3.1 ; port ESP_TXD
MAG_SCL: U7.A2(SCL) ; port MAG_SCL  [project net EEPROM_SCL]
MAG_SDA: U7.B2(SDA) ; port MAG_SDA  [project net EEPROM_SDA]
NetR1_2: R1.2 U13.17(~{SPICS})
NetR31_2: R31.2 U13.20(SPICLK)
NetR32_2: R32.2 U13.19(SPIMISO)
NetR33_2: R33.2 U13.18(SPIMOSI)

Not connected (* = marked no-connect by the designer): U13 11(GPIO4)*

### Notes on the sheet
- I2C Address: 0b01100 000x
  0x30h

### Library data of the parts
C29 = CMP-06035-063009-1: CAP CER 2.2UF 10V X5R 0402; Material: Ceramic; Tolerance: 10%; Max Operating Temperature: 85°C; Min Operating Temperature: -55°C; Weight: 0.000212oz; Lead Free: Lead Free; Case Code (Imperial): 0402; Case Code (Metric): 1005; Length: 1mm; Packaging: Tape and Reel; Depth: 0.5mm; Voltage Rating: 10V; REACH SVHC: No SVHC; Width: 0.5mm; Case/Package: 0402; RoHS Compliant: Yes; Termination: SMD/SMT; Voltage Rating (DC): 10V; Height: 0.5mm; Mount: Surface Mount; Package Quantity: 10000; Dielectric: X5R; Thickness: 0.022inch
C33 = CMP-2000-05448-2: CAP CER 10UF 10V X5R 0603; Manufacturer: Murata; Temperature Coefficient: 15%; Material: Ceramic; Tolerance: 10%; Device Class L1: Passive Components; ComponentLink2Description: Datasheet; Height: 0.95mm; Package: GRM18-0.15; Octopart: https://octopart.com/grm188r61a106ke69d-murata-22851381; Manufacturer Part Number: GRM188R61A106KE69D; Value: 10uF; Digikey Description: CAP CER 10UF 10V X5R 0603; Temperature Range High: +85°C; Temperature Range Low: -55°C; Temperature Characteristic: X5R; RoHS: TRUE; Device Class L2: Capacitors; ComponentLink2URL: https://search.murata.co.jp/Ceramy/image/img/A01X/G101/ENG/GRM188R61A106KE69-01A.pdf; Device Class L3: Ceramic Capacitors; Lead Free: Yes; Mouser Description: Multilayer Ceramic Capacitors MLCC - SMD/SMT 0603 10uF 10volts X5R + - 10%; Category: Cap; Voltage Rating: 10V; Temperature: -55°C to +85°C; Automotive: No
J3 = CMP-1502-01329-3: NexarPartId: 61924725; Operating Supply Voltage: 250V; Contact Resistance: 20mΩ; Gender: Female; Current Rating: 3A; RoHS: Non-Compliant; Lead Pitch: 2.54mm; Number of Pins: 8; Orientation: Vertical
R1 R21 R22 R30-R33 = CMP-009-00183-1: Design Item ID: Generic RES 0402; Source: Schlib1.SchLib
  R1 R31-R33: Value: 0R
  R21 R22 R30: Value: 10k
U7 = CMP-044-000000-1: Magnetoresistive Sensor X, Y, Z Axis 4-WLP (0.82x0.82); MF: Memsic Inc.; Design Item ID: MMC5603NJ; Value: *; Pin Count: 4; MP: MMC5603NJ; Check_prices: https://www.snapeda.com/parts/MMC5603NJ/Memsic+Inc./view-part/?ref=eda; Availability: In Stock; Price: None; Component Type: Standard; SnapEDA_Link: https://www.snapeda.com/parts/MMC5603NJ/Memsic+Inc./view-part/?ref=snap; Source: MMC5603NJ.SchLib; Package: UFBGA-4 Memsic Inc.; Purchase-URL: https://pricing.snapeda.com/search/part/MMC5603NJ/?ref=eda
U13 = CMP-046-000000-1: 802.15.4, Bluetooth, Cellular UWB, ZigbeeÂ® Transceiver Module 6.25GHz ~ 8.25GHz Integrated, Ceramic Patch Surface Mount; MF: Qorvo; Design Item ID: DWM3000TR13; Package: None; SnapEDA_Link: https://www.snapeda.com/parts/DWM3000TR13/Qorvo/view-part/?ref=snap; Check_prices: https://www.snapeda.com/parts/DWM3000TR13/Qorvo/view-part/?ref=eda; Value: *; MP: DWM3000TR13; Source: DWM3000TR13.SchLib; Pin Count: 24; Component Type: Standard

## Sheet Interface.SchDoc
size B
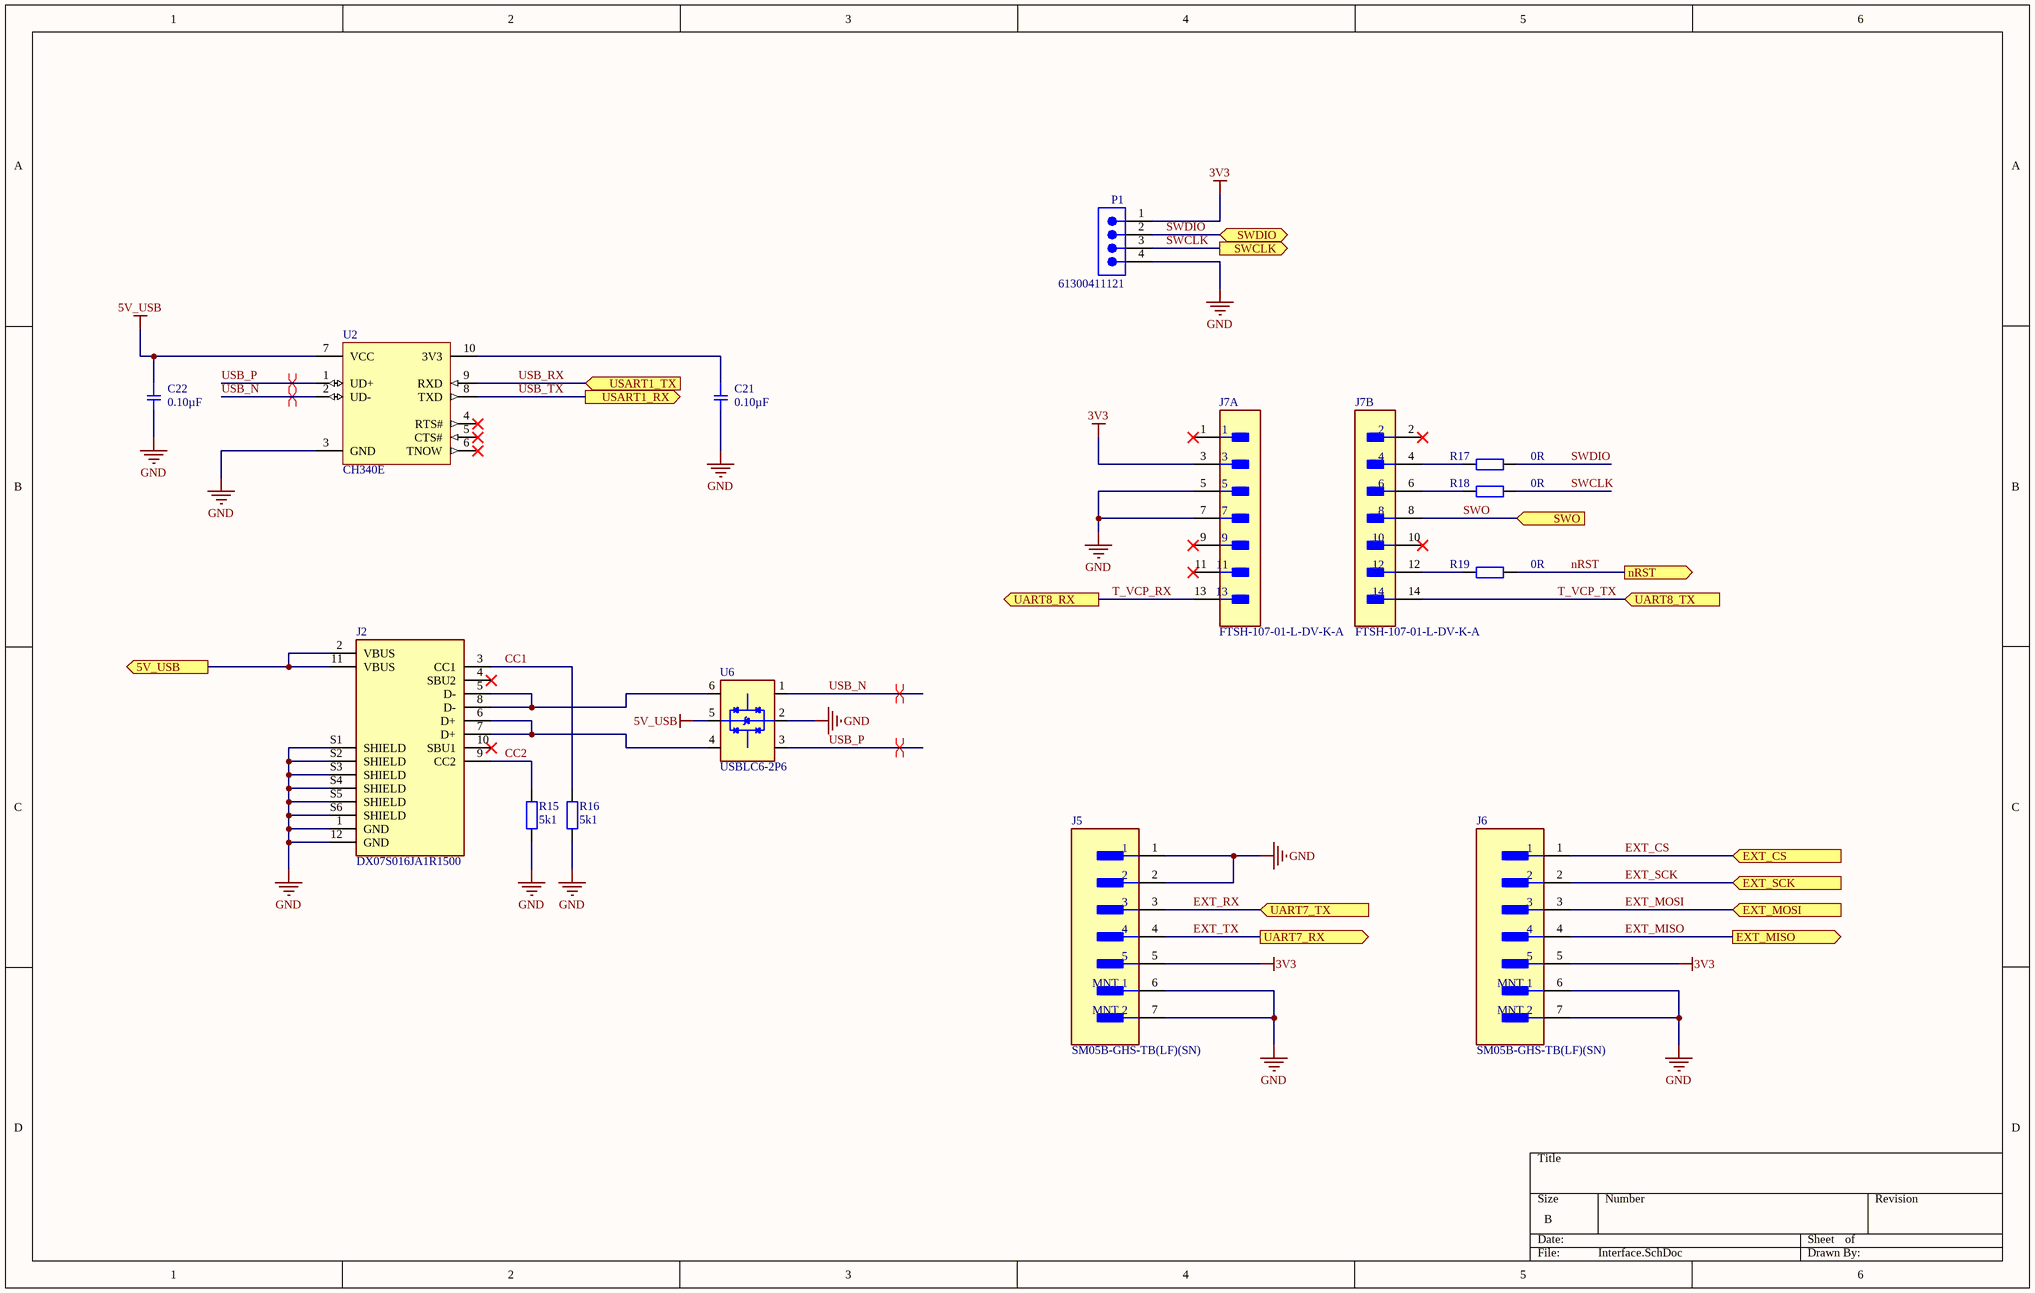
[diagram p4: Interface.SchDoc]

### Parts
C21  value 0.10µF  [SMD-0402C]  (hidden comment: GRM155R61A104KA01J)
C22  value 0.10µF  [SMD-0402C]  (hidden comment: GRM155R61A104KA01J)
J2  DX07S016JA1R1500  [JAE_DX07S016JA1R1500]
J5  SM05B-GHS-TB(LF)(SN)  [FP-SM05B-GHS-TB_LF_SN-MFG]
J6  SM05B-GHS-TB(LF)(SN)  [FP-SM05B-GHS-TB_LF_SN-MFG]
J7  FTSH-107-01-L-DV-K-A  [FP-FTSH-107-01-L-DV-K-A-MFG]  (parts A,B of 2)
P1  61300411121  [61300411121]
R15  value 5k1  [IPC C R0402 NO SILK]  (hidden comment: 5.1k)
R16  value 5k1  [IPC C R0402 NO SILK]  (hidden comment: 5.1k)
R17  0R  [IPC C R0402 NO SILK]
R18  0R  [IPC C R0402 NO SILK]
R19  0R  [IPC C R0402 NO SILK]
U2  CH340E  [MSOP-UN10_L]
U6  USBLC6-2P6  [SOT50P160X60-6N]

### Ports
5V_USB (out), EXT_CS (in), EXT_MISO (out), EXT_MOSI (in), EXT_SCK (in), nRST (out), SWCLK (out), SWDIO (bidir), SWO (in), UART7_RX (out), UART7_TX (in), UART8_RX (out), UART8_TX (in), USART1_RX (out), USART1_TX (in)

### Nets
3V3: J5.5 J6.5 J7.3 P1.1
5V_USB: C22.1 J2.2(VBUS) J2.11(VBUS) U2.7(VCC) U6.5(VBUS) ; port 5V_USB
GND: C21.2 C22.2 J2.1(GND) J2.12(GND) J2.S1(SHIELD) J2.S2(SHIELD) J2.S3(SHIELD) J2.S4(SHIELD) J2.S5(SHIELD) J2.S6(SHIELD) J5.1 J5.2 J5.6(MNT_1) J5.7(MNT_2) J6.6(MNT_1) J6.7(MNT_2) J7.5 J7.7 P1.4 R15.2 R16.2 U2.3(GND) U6.2(GND)
CC1: J2.3(CC1) R16.1
CC2: J2.9(CC2) R15.1
EXT_CS: J6.1 ; port EXT_CS
EXT_MISO: J6.4 ; port EXT_MISO
EXT_MOSI: J6.3 ; port EXT_MOSI
EXT_RX: J5.3 ; port UART7_TX
EXT_SCK: J6.2 ; port EXT_SCK
EXT_TX: J5.4 ; port UART7_RX
nRST: R19.2 ; port nRST
SWCLK: P1.3 R18.2 ; port SWCLK
SWDIO: P1.2 R17.2 ; port SWDIO
SWO: J7.8 ; port SWO
T_VCP_RX: J7.13 ; port UART8_RX
T_VCP_TX: J7.14 ; port UART8_TX
USB_N: U2.2(UD-) U6.1(I/O1_1)
USB_P: U2.1(UD+) U6.3(I/O2_1)
USB_RX: U2.9(RXD) ; port USART1_TX  [project net USART1_TX]
USB_TX: U2.8(TXD) ; port USART1_RX  [project net USART1_RX]
NetC21_1: C21.1 U2.10(3V3)
NetJ2_5: J2.5(D-) J2.8(D-) U6.6(I/O1_2)
NetJ2_6: J2.6(D+) J2.7(D+) U6.4(I/O2_2)
NetJ7_4: J7.4 R17.1
NetJ7_6: J7.6 R18.1
NetJ7_12: J7.12 R19.1

Not connected (* = marked no-connect by the designer): J2 4(SBU2)* 10(SBU1)*; J7 1* 2* 9* 10* 11*; U2 4(RTS#)* 5(CTS#)* 6(TNOW)*

### Layout directives
differential pair: USB_N, USB_P

### Library data of the parts
C21 C22 = CMP-140-000687-1: as C2 on sheet MCU; Ratings: -; Lead Spacing: -; Source: capacitor_murata_0402$.SchLib; Part Status: Active; Pin Count: 2; Digi-Key Part Number: 490-6297-1-ND; Operating Temperature: -55°C ~ 85°C; Height - Seated (Max): -; Voltage: 10V; @ qty: 0; Temperature Coefficient: X5R; Package / Case: 0402 (1005 Metric); Size / Dimension: 0.039" L x 0.020" W (1.00mm x 0.50mm); Quantity Available: 24406; Datasheets: http://www.murata.com/~/media/webrenewal/support/library/catalog/products/capacitor/mlcc/c02e.pdf; Series: GRM; Applications: General Purpose; Thickness (Max): 0.022" (0.55mm); Image: //media.digikey.com/Renders/Murata%20Renders/ZRB-SERIES-0402.jpg; Packaging: Cut Tape (CT); Part Number: GRM155R61A104KA01J; Features: -; Component Type: Standard; Mounting Type: Surface Mount, MLCC; Design Item ID: GRM155R61A104KA01J
J2 = CMP-003-000003-4: USB-C (USB TYPE-C) USB 2.0 Receptacle Connector 24 (16+8 Dummy) Position Surface Mount, Right Angle; Through Hole; Pin Count: 18; Component Type: Standard; Availability: Unavailable; Design Item ID: DX07S016JA1R1500; Price: None; Value: *; Source: DX07S016JA1R1500.SchLib; Package: None; MP: DX07S016JA1R1500
J5 J6 = CMP-17439-000048-1: CONN HEADER SMD R/A 5POS 1.25MM; Current Rating: 1A; Pitch: 0.049inch; Connector Type: Outer Shroud Contact; Number of Positions: 5; Voltage Rating (AC): 50V; Wire/Cable Gauge: 26AWG; Series: GH; Mount: Surface Mount; Housing Material: Nylon; Contact Type: Outer Shroud Contact; REACH SVHC: No SVHC; Number of Rows: 1; Lead Free: Lead Free; Color: Natural; Contact Material: Bronze; Contact Plating: Tin; Max Operating Temperature: 85°C; Orientation: Right Angle; Number of Contacts: 5; Voltage Rating: 50V; Housing Color: Natural; Termination: Solder; Min Operating Temperature: -25°C; Fastening Type: Ramp; Packaging: Tape and Reel
J7 = CMP-02766-001414-1: CONN HEADER SMD 14POS 1.27MM; Number of Contacts: 14; Gender: Male; Contact Plating: Gold; Termination: Solder; Lead Free: Lead Free; Contact Material: Bronze; Pitch: 1.27mm; Number of Rows: 2; RoHS Compliant: Yes
P1 = CMP-1502-01064-4: THT Vertical Pin Header WR-PHD, Pitch 2.54 mm, Single Row, 4 pins; Connector Type: Male Pin; Gender: Male; Current Rating: 3A; Number of Positions: 4; Operating Supply Voltage: 250V; Contact Resistance: 20mΩ; Pitch: 2.54mm; Max Operating Temperature: 105°C; Mount: Through Hole; Contact Material: Gold; Contact Plating: Gold; Number of Contacts: 4; Orientation: Vertical; Packaging: Bulk; Contact Mating Length: 5.9944mm; Voltage Rating: 250V; Number of Rows: 1; Height: 8.89mm; Lead Free: Lead Free; Lead Pitch: 2.54mm; Number of Pins: 4; Color: Black; Min Operating Temperature: -40°C; RoHS: Compliant; Termination: Solder
R15-R19 = CMP-009-00183-1: Design Item ID: Generic RES 0402; Source: Schlib1.SchLib
  R17-R19: Value: 0R
U2 = CMP-023-000028-1: Source: Schlib1.SchLib; Design Item ID: CH340E
U6 = CMP-004-00043-1: 17V Clamp 5A (8/20Âµs) Ipp Tvs Diode Surface Mount SOT-666; MF: STMicroelectronics; Component Type: Standard; Check_prices: https://www.snapeda.com/parts/USBLC6-2P6/STMicroelectronics/view-part/?ref=eda; Value: *; Design Item ID: USBLC6-2P6; MP: USBLC6-2P6; Pins: 6; Case/Package: SOT-666 STMicroelectronics; SnapEDA_Link: https://www.snapeda.com/parts/USBLC6-2P6/STMicroelectronics/view-part/?ref=snap; Source: USBLC6-2P6.SchLib

## Sheet Storage.SchDoc
size A4
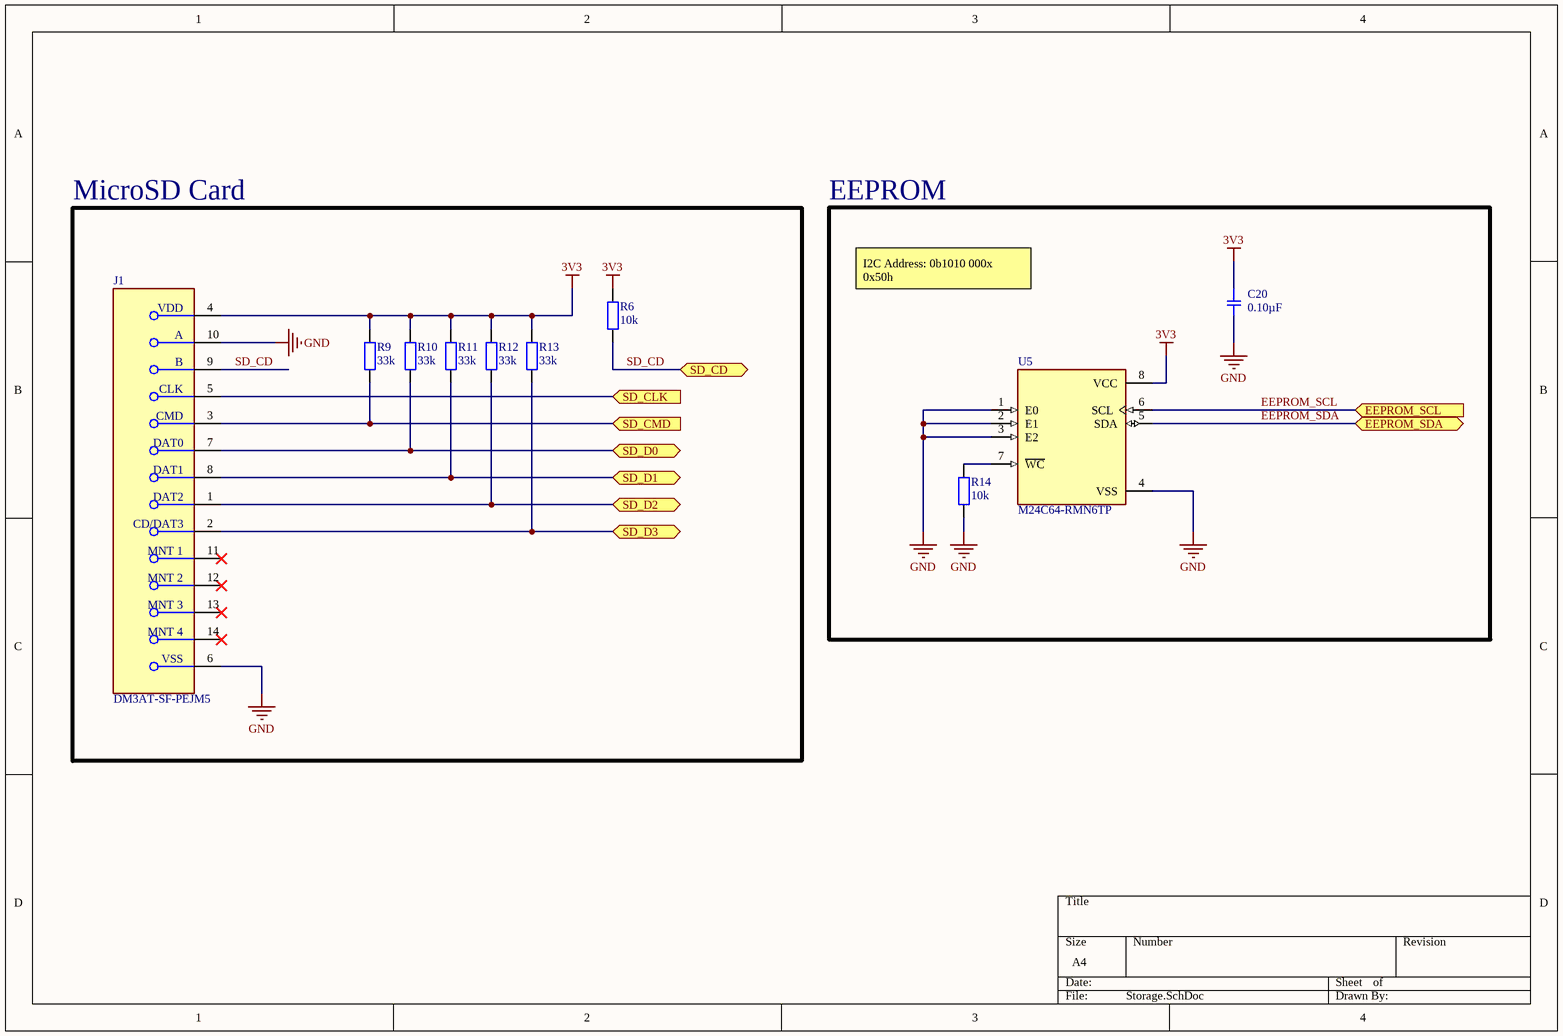
[diagram p5: Storage.SchDoc]

### Parts
C20  value 0.10µF  [SMD-0402C]  (hidden comment: GRM155R61A104KA01J)
J1  DM3AT-SF-PEJM5  [FP-DM3AT-SF-PEJM5-MFG]
R6  10k  [IPC C R0402 NO SILK]
R9  33k  [IPC C R0402 NO SILK]
R10  33k  [IPC C R0402 NO SILK]
R11  33k  [IPC C R0402 NO SILK]
R12  33k  [IPC C R0402 NO SILK]
R13  33k  [IPC C R0402 NO SILK]
R14  10k  [IPC C R0402 NO SILK]
U5  M24C64-RMN6TP  [SOIC127P600X175-8N]

### Blocks framed on the sheet
MicroSD Card: J1 R6 R9-R13
EEPROM: C20 R14 U5

### Ports
EEPROM_SCL (in), EEPROM_SDA (bidir), SD_CD (bidir), SD_CLK (in), SD_CMD (in), SD_D0 (bidir), SD_D1 (bidir), SD_D2 (bidir), SD_D3 (bidir)

### Nets
3V3: C20.1 J1.4(VDD) R6.2 R9.2 R10.2 R11.2 R12.2 R13.2 U5.8(VCC)
GND: C20.2 J1.6(VSS) J1.10(A) R14.2 U5.1(E0) U5.2(E1) U5.3(E2) U5.4(VSS)
EEPROM_SCL: U5.6(SCL) ; port EEPROM_SCL
EEPROM_SDA: U5.5(SDA) ; port EEPROM_SDA
SD_CD: J1.9(B) R6.1 ; port SD_CD
SD_CLK: J1.5(CLK) ; port SD_CLK
SD_CMD: J1.3(CMD) R9.1 ; port SD_CMD
SD_D0: J1.7(DAT0) R10.1 ; port SD_D0
SD_D1: J1.8(DAT1) R11.1 ; port SD_D1
SD_D2: J1.1(DAT2) R12.1 ; port SD_D2
SD_D3: J1.2(CD/DAT3) R13.1 ; port SD_D3
NetR14_1: R14.1 U5.7(~{WC})

Not connected (* = marked no-connect by the designer): J1 11(MNT_1)* 12(MNT_2)* 13(MNT_3)* 14(MNT_4)*

### Notes on the sheet
- I2C Address: 0b1010 000x
  0x50h

### Library data of the parts
C20 = CMP-140-000687-1: as C2 on sheet MCU; Ratings: -; Lead Spacing: -; Source: capacitor_murata_0402$.SchLib; Part Status: Active; Pin Count: 2; Digi-Key Part Number: 490-6297-1-ND; Operating Temperature: -55°C ~ 85°C; Height - Seated (Max): -; Voltage: 10V; @ qty: 0; Temperature Coefficient: X5R; Package / Case: 0402 (1005 Metric); Size / Dimension: 0.039" L x 0.020" W (1.00mm x 0.50mm); Quantity Available: 24406; Datasheets: http://www.murata.com/~/media/webrenewal/support/library/catalog/products/capacitor/mlcc/c02e.pdf; Series: GRM; Applications: General Purpose; Thickness (Max): 0.022" (0.55mm); Image: //media.digikey.com/Renders/Murata%20Renders/ZRB-SERIES-0402.jpg; Packaging: Cut Tape (CT); Part Number: GRM155R61A104KA01J; Features: -; Component Type: Standard; Mounting Type: Surface Mount, MLCC; Design Item ID: GRM155R61A104KA01J
J1 = CMP-2000-05150-2: CONN MICRO SD CARD PUSH-PUSH R/A; Current Rating: 500mA; Number of Contacts: 8; Pitch: 1.1mm; Gender: Female; Connector Type: Connector; Max Voltage Rating (AC): 125V; Min Operating Temperature: -25°C; Length: 15.95mm; Packaging: Tape and Reel; Width: 13.85mm; Flammability Rating: UL94 V-0; Termination: SMD/SMT; Contact Material: Copper Alloy; Depth: 15.95mm; Radiation Hardening: No; Number of Rows: 1; Max Operating Temperature: 85°C; Housing Material: Polymer; Height: 1.68mm; Package Quantity: 1; Orientation: Right Angle; REACH SVHC: No SVHC; Mount: Surface Mount; Max Current Rating: 500mA; Number of Positions: 8; Lead Free: Lead Free; Contact Plating: Gold; Voltage Rating: 125V
R6 R9-R14 = CMP-009-00183-1: Design Item ID: Generic RES 0402; Source: Schlib1.SchLib
  R6 R14: Value: 10k
  R9-R13: Value: 33k
U5 = CMP-038-000000-1: Package: None; Price: None; Pin Count: 8; Availability: Unavailable; MP: M24C64-RMN6TP; Design Item ID: M24C64-RMN6TP; Source: M24C64-RMN6TP.SchLib; Value: *; Component Type: Standard